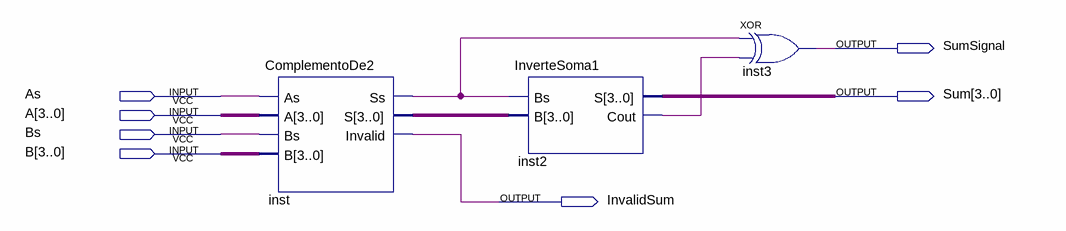
[diagram p0: schematic sheet]
// Quartus schematic SomadorDe4BitsComSinal.bdf as structural Verilog: 3 symbols, 7 pins
module SomadorDe4BitsComSinal (
  input  As,
  input  [3:0] A,
  input  Bs,
  input  [3:0] B,
  output SumSignal,
  output [3:0] Sum,
  output InvalidSum
);

  wire inst2_cout, inst_ss;
  wire [3:0] inst_s;

  ComplementoDe2 inst (.A(A), .B(B), .As(As), .Bs(Bs), .S(inst_s), .Invalid(InvalidSum), .Ss(inst_ss));
  InverteSoma1 inst2 (.Bs(inst_ss), .B(inst_s), .S(Sum), .Cout(inst2_cout));
  xor inst3 (SumSignal, inst_ss, inst2_cout);
endmodule
